# EAGLE schematic 5V Voltage Regulator For Servos (EAGLE 8.2.1)
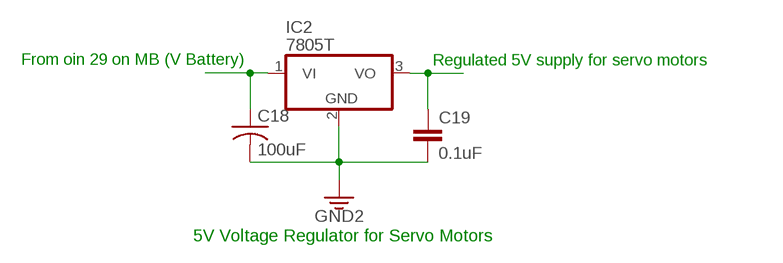
[diagram p0: schematic, sheet 1]

## Parts
C18  100uF  C-US025-024X044  [C025-024X044]
C19  0.1uF  2.2UF-CERCAP-10009  [1206]
IC2  7805T  [TO220H]

## Nets
GND [VSERVO]: C18.2 C19.2 IC2.2(GND) ; supply symbol labelled GND2
VBATTERY [VSERVO]: C18.1 IC2.1(VI)
VSERVO [VSERVO]: C19.1 IC2.3(VO)

## Notes on the sheet
- From oin 29 on MB (V Battery) | Regulated 5V supply for servo motors
- 5V Voltage Regulator for Servo Motors

## Library data of the parts
C18 = adafruit:C-US: CAPACITOR, American symbol
C19 = SparkFun-Retired:2.2UF-CER: 2.2uF Ceramic SMT CAP-07888- 10V, 20% (0603) CAP-10009- 50V, 10% (1206); PROD_ID: CAP-10009; VALUE: 2.2uF
IC2 = adafruit:78*: Positive VOLTAGE REGULATOR Added bigger pads to the TO-92 package

## Net classes
1 VSERVO: width 0.8 mm, clearance 0.2 mm
2 VDD: width 0.5 mm, clearance 0.2 mm